# EAGLE design kolrs868_tx (EAGLE 6.5.0)
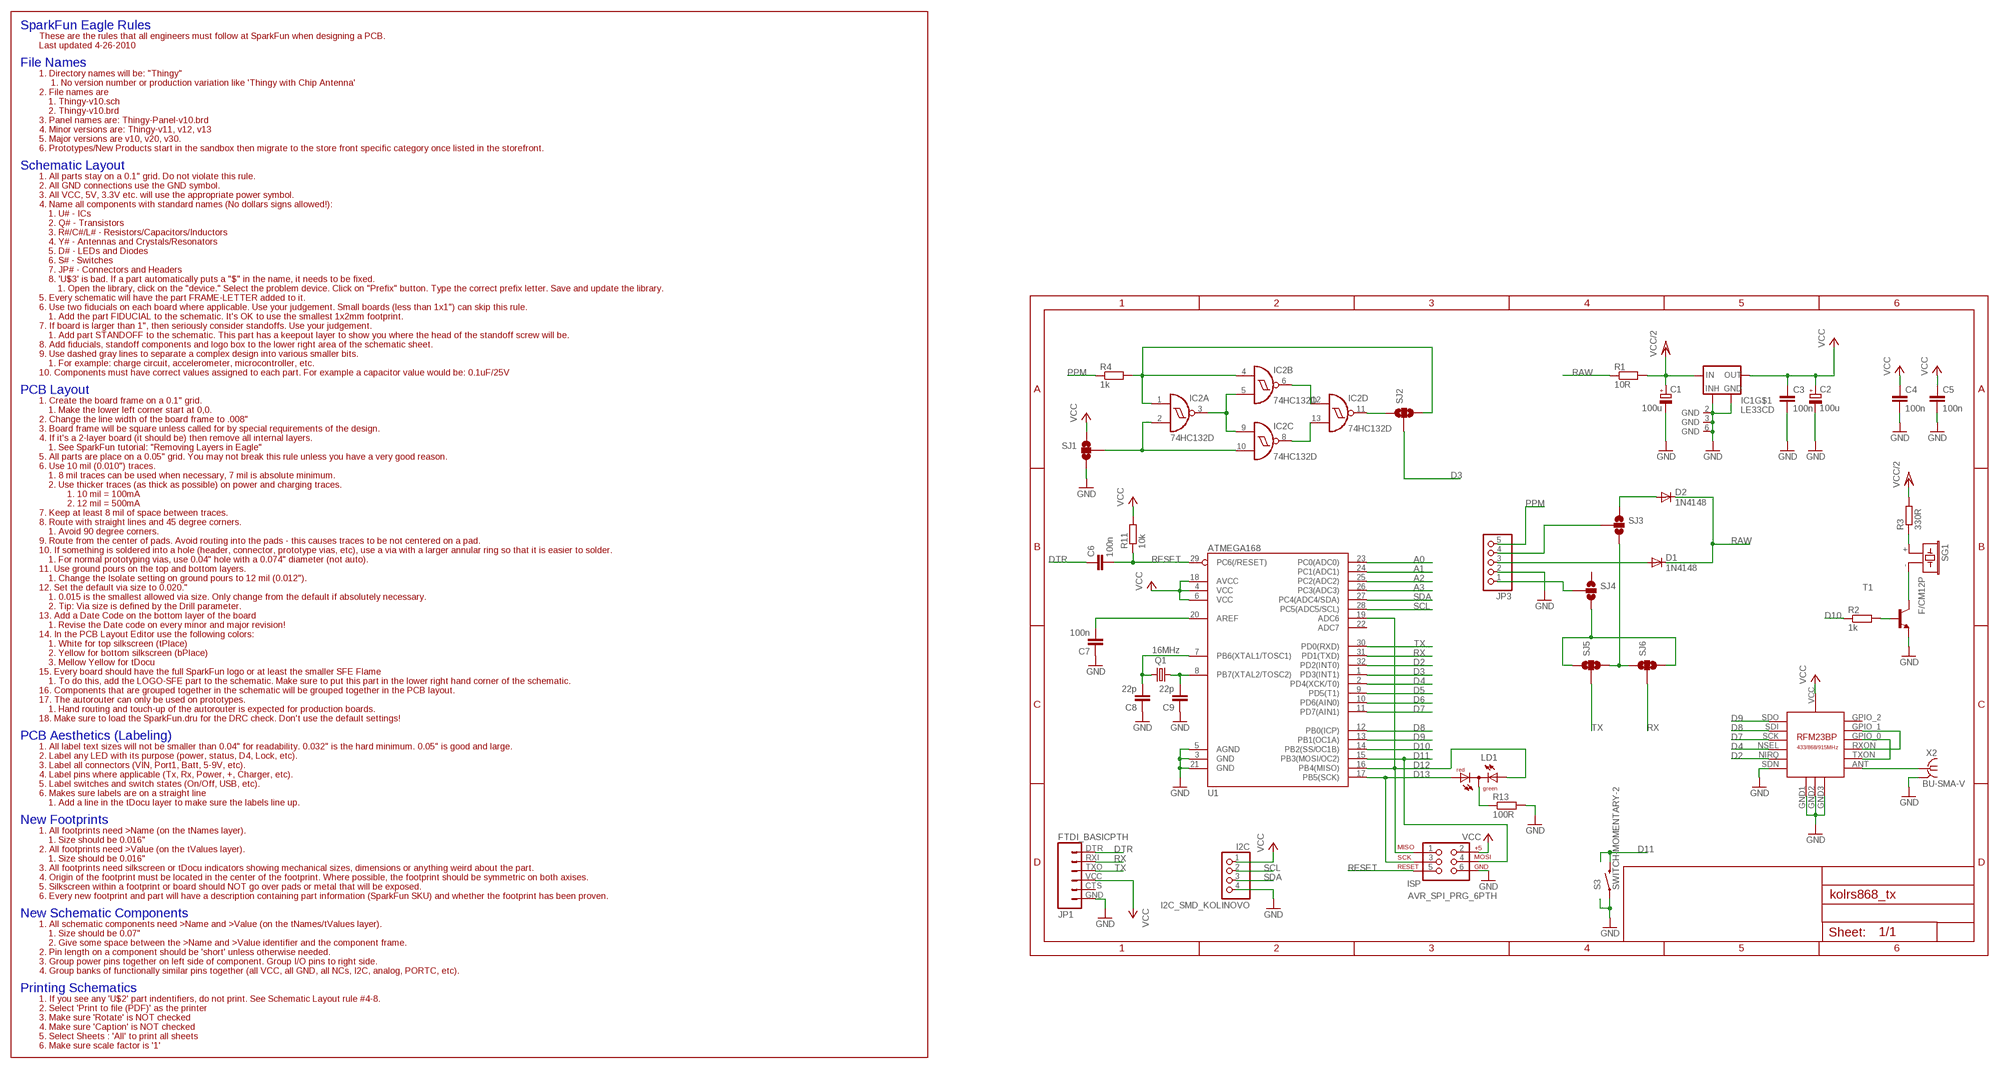
[diagram p0: schematic, sheet 1]

## Parts
C1  100u  CPOL-EUSMCB  [SMC_B]
C2  100u  CPOL-EUSMCB  [SMC_B]
C3  100n  C-EU_KOLIN  [M0805]
C4  100n  C-EU_KOLIN  [M0805]
C5  100n  C-EU_KOLIN  [M0805]
C6  100n  C-EU_KOLIN  [M0805]
C7  100n  C-EU_KOLIN  [M0805]
C8  22p  C-EU_KOLIN  [M0805]
C9  22p  C-EU_KOLIN  [M0805]
D1  1N4148  DIODE-MINIMELF  [MINIMELF]
D2  1N4148  DIODE-MINIMELF  [MINIMELF]
I2C  I2C_SMD_KOLINOVO  [1X04]
IC1  LE33CD  [SO8]
IC2  74HC132D  [SO14]
ISP  AVR_SPI_PRG_6PTH  [2X3]
JP1  FTDI_BASICPTH  [FTDI_BASIC]
JP3  PINHD-1X5  [1X05]
LD1  DUOLED-RG-C  [DUOLED-C-5MM]
Q1  16MHz  CRYSTALHC49UP  [HC49UP]
R1  10R  R-EU_KOLINM0805  [M0805]
R2  1k  R-EU_KOLINM0805  [M0805]
R3  330R  R-EU_KOLINM0805  [M0805]
R4  1k  R-EU_KOLINM0805  [M0805]
R11  10k  R-EU_KOLINM0805  [M0805]
R13  100R  R-EU_KOLINM0805  [M0805]
S3  SWITCH-MOMENTARY-2  [TACTILE_SWITCH_TALL]
SG1  F/CM12P  [F/CM12P]
SJ1  SOLDERJUMPER_2WAYS  [SJ_3]
SJ2  SOLDERJUMPER_2WAYS  [SJ_3]
SJ3  SOLDERJUMPER_2WAYS  [SJ_3]
SJ4  SOLDERJUMPER_2WAYS  [SJ_3]
SJ5  SOLDERJUMPER_2WAYS  [SJ_3]
SJ6  SOLDERJUMPER_2WAYS  [SJ_3]
T1  BC848-NPN-SOT23-BEC  [SOT23-BEC]
U1  ATMEGA168  [TQFP32-08]
U$3  RFM23BP  [RFM23BP]
X2  BU-SMA-V  [BU-SMA-V]

## Nets
A0: U1.23(PC0(ADC0))
A1: U1.24(PC1(ADC1))
A2: U1.25(PC2(ADC2))
A3: U1.26(PC3(ADC3))
D2: U1.32(PD2(INT0)) U$3.NIRQ
D3: SJ2.2 U1.1(PD3(INT1))
D4: U1.2(PD4(XCK/T0)) U$3.NSEL
D5: U1.9(PD5(T1))
D6: U1.10(PD6(AIN0))
D7: U1.11(PD7(AIN1)) U$3.SCK
D8: U1.12(PB0(ICP)) U$3.SDI
D9: U1.13(PB1(OC1A)) U$3.SDO
D10: R2.1 U1.14(PB2(SS/OC1B))
D11: ISP.4 S3.B2 U1.15(PB3(MOSI/OC2))
D12: ISP.1 LD1.AX(AG) U1.16(PB4(MISO)) U1.19(ADC6)
D13: ISP.3 LD1.AR U1.17(PB5(SCK))
DTR: C6.1 JP1.DTR
GND: C1.- C2.- C3.2 C4.2 C5.2 C7.1 C8.1 C9.1 I2C.4 IC1.2(GND) IC1.3(GND) IC1.5(INHIBIT) IC1.6(GND) IC1.7(GND) ISP.6 JP1.GND JP3.2 R13.2 S3.A2 SJ1.3 T1.E U1.3(GND) U1.5(AGND) U1.21(GND) U$3.GND1 U$3.GND2 U$3.GND3 U$3.SDN X2.2(GND)
N$1: C7.2 U1.20(AREF)
N$4: U$3.ANT X2.1
N$5: JP3.1 SJ4.2
N$6: C8.2 Q1.2 U1.7(PB6(XTAL1/TOSC1))
N$7: C9.2 Q1.1 U1.8(PB7(XTAL2/TOSC2))
N$8: LD1.C R13.1
N$10: R2.2 T1.B
N$11: SG1.- T1.C
N$12: R3.1 SG1.+
N$13: D1.A JP3.3
N$14: JP3.4 SJ3.2
N$16: D2.A SJ3.1
N$17: IC2.3(A:O) IC2.5(B:I1) IC2.9(C:I0)
N$18: IC2.11(D:O) SJ2.1
N$19: IC2.2(A:I1) IC2.10(C:I1) SJ1.2
N$20: IC2.8(C:O) IC2.13(D:I1)
N$21: IC2.6(B:O) IC2.12(D:I0)
N$24: IC2.1(A:I0) IC2.4(B:I0) R4.2 SJ2.3
N$25: SJ4.3 SJ5.1 SJ6.3
N$26: SJ3.3 SJ5.3 SJ6.1
N$31: U$3.GPIO_0 U$3.TXON
N$32: U$3.GPIO_1 U$3.RXON
PPM: JP3.5 R4.1
RAW: D1.C D2.C R1.1
RESET: C6.2 ISP.5 R11.1 U1.29(PC6(/RESET))
RX: JP1.RXI SJ6.2 U1.31(PD1(TXD))
SCL: I2C.2 U1.28(PC5(ADC5/SCL))
SDA: I2C.3 U1.27(PC4(ADC4/SDA))
TX: JP1.TXO SJ5.2 U1.30(PD0(RXD))
VCC: C2.+ C3.1 C4.1 C5.1 I2C.1 IC1.1(OUT) ISP.2 JP1.VCC R11.2 SJ1.1 U1.4(VCC) U1.6(VCC) U1.18(AVCC) U$3.VCC
VCC/2: C1.+ IC1.8(IN) R1.2 R3.2
Unconnected: JP1.CTS SJ4.1 U1.22(ADC7) U$3.GPIO_2

## Power pins joined to a net without a drawn wire
GND: IC2.7(P:GND) X2.3(GND) X2.4(GND) X2.5(GND)
VCC: IC2.14(P:VCC)

## Library data of the parts
C1 C2 = rcl:CPOL-EU: POLARIZED CAPACITOR, European symbol
C3-C9 = PINHEAD_RC:C-EU_KOLIN: CAPACITOR, European symbol
D1 D2 = diode:DIODE-: DIODE
I2C = PINHEAD_RC:I2C_SMD_KOLINOVO: PIN HEADER
IC1 = libstabilizatory:LE33CD: VOLTAGE REGULATOR WITH INHIBIT
IC2 = 74xx-eu:74*132: Quad 2-input NAND schmitt trigger
ISP = SparkFun:AVR_SPI_PRG_6: AVR ISP 6 Pin This is the reduced ISP connector for AVR programming. Common on Arduino. This footprint will take up less PCB space and can be used with a 10-pin to 6-pin adapter such as SKU: BOB-08508
JP1 = SparkFun:FTDI_BASIC: FTDI Basic: 3.3V and 5V
JP3 = pinhead:PINHD-1X5: PIN HEADER
LD1 = led:DUOLED-RG-C: DUO LED 2 colors (red/green), 5 mm, round, common Cathode www.ligitek.com or other producers.
Q1 = crystal:CRYSTAL: CRYSTAL; OC_FARNELL: unknown; OC_NEWARK: unknown
R1-R4 R11 R13 = PINHEAD_RC:R-EU_KOLIN: RESISTOR, European symbol
S3 = SparkFun:SWITCH-MOMENTARY-2
SG1 = buzzer:F/CM12P: BUZZER Source: Buerklin
SJ1-SJ6 = SparkFun:SOLDERJUMPER_2WAY: Solder Jumper 2 way solder jumper
T1 = transistor:*-NPN-: NPN Transistror BF959 corrected 2008.03.06
U1 = SparkFun:ATMEGA168
U$3 = RFM23BP:RFM23BP: HopeRF RFM23BP Library by: http://projects.weber-itam.de
X2 = con-coax:BU-SMA-V: FEMALE SMA CONNECTOR Radiall distributor RS 112-3794; OC_FARNELL: unknown; OC_NEWARK: unknown

## Board
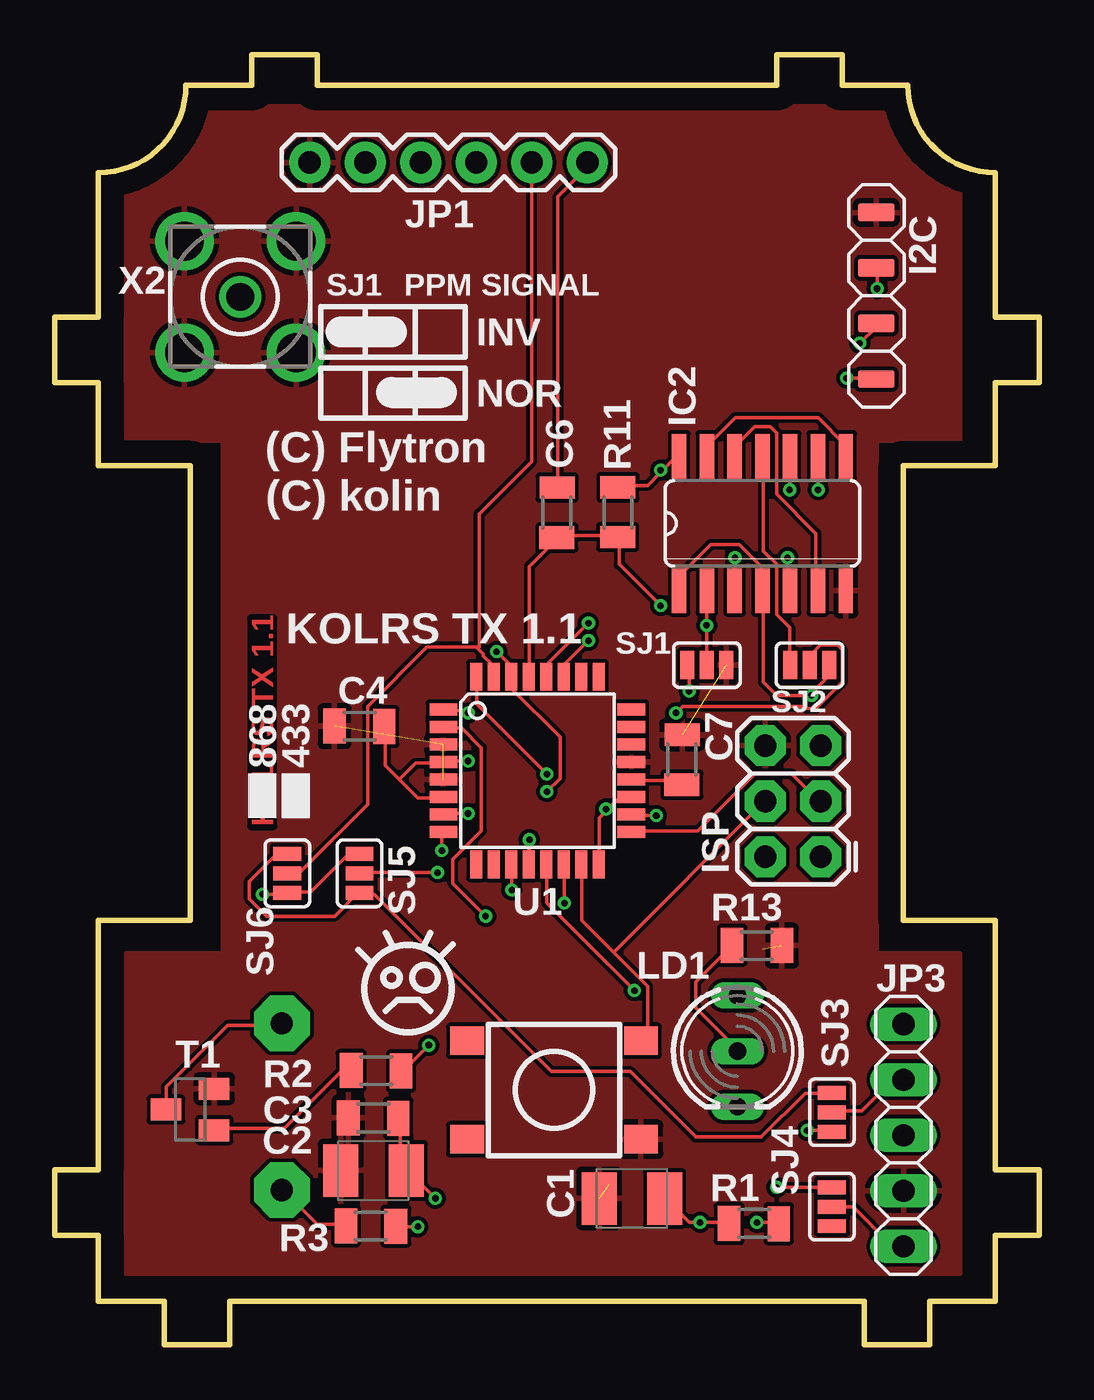
[diagram p1: board, top side]
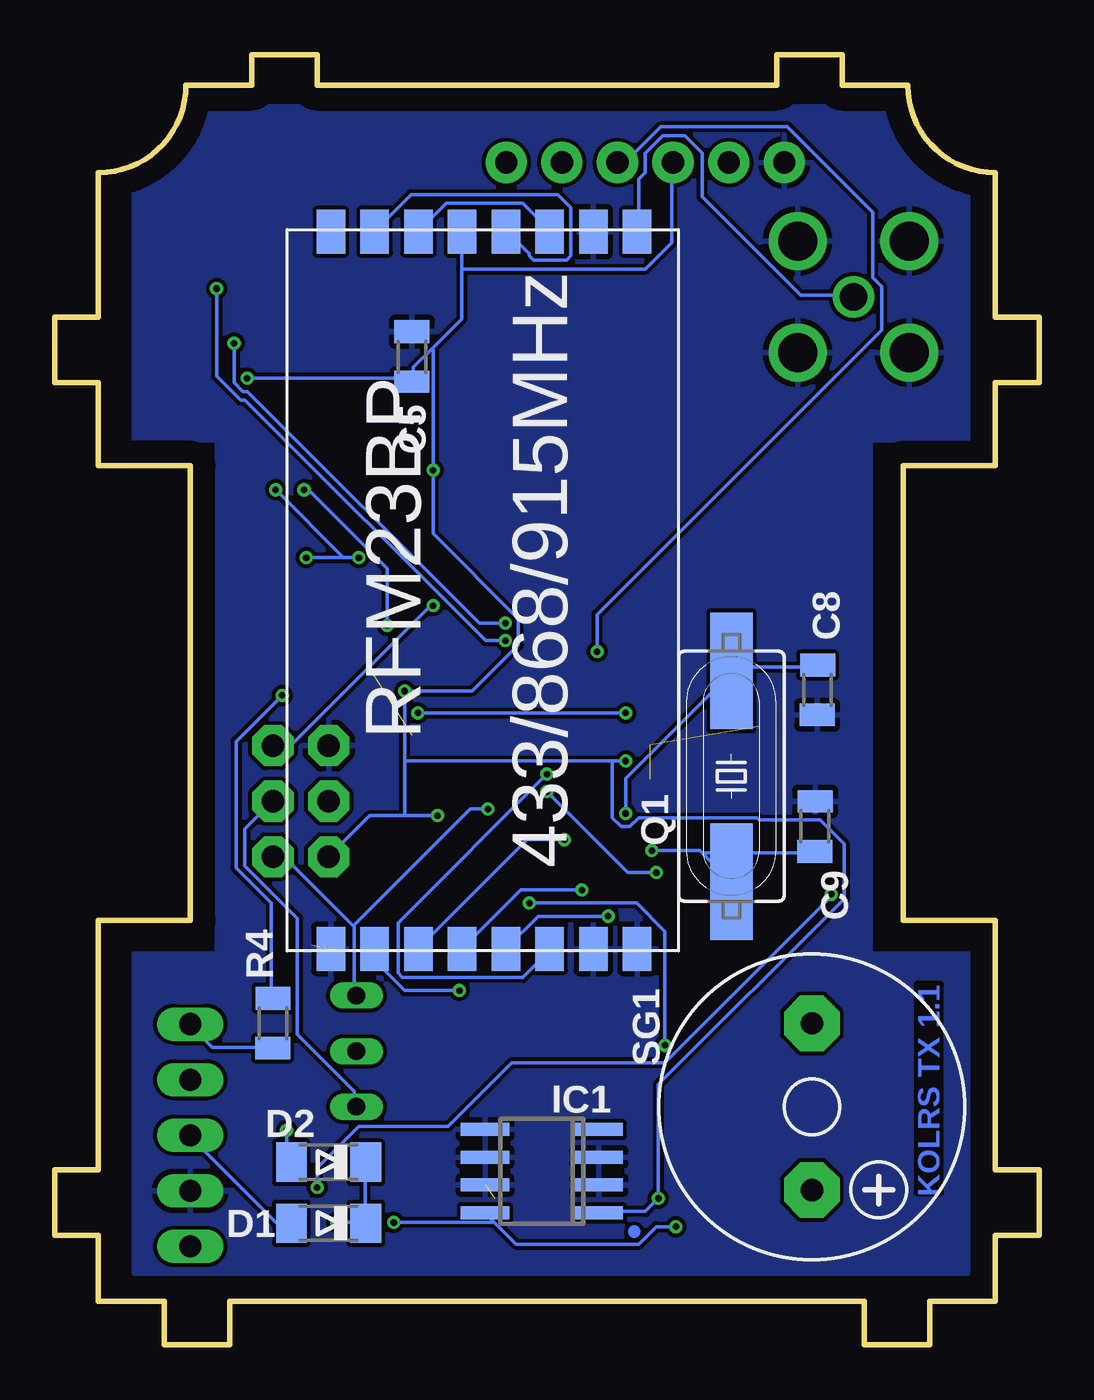
[diagram p2: board, bottom side, seen from below]

Size 45 x 59 mm. Coordinates in mm from the lower left corner, seen from the top.
Outline: 2,2 5,2 5,0 8,0 8,2 37,2 37,0 40,0 40,2 43,2 43,5 45,5 45,8 43,8 43,19.4 38.8,19.4 38.8,40.2 43,40.2 43,44 45,44 45,47 43,47 43,53.6 arc-90 39,57.6 36,57.6 36,59 33,59 33,57.6 12,57.6 12,59 9,59 9,57.6 6,57.6 arc-90 2,53.6 2,47 0,47 0,44 2,44 2,40.2 6.2,40.2 6.2,19.4 2,19.4 2,8 0,8 0,5 2,5 2,2
Copper layers (1*16): Top 0.018mm / dielectric 1.5mm / Bottom 0.018mm
Design rules "default": minimum track width 0.15mm, minimum drill 0.3mm, track to track 0.18mm, track to pad 0.18mm, pad to pad 0.18mm, via to via 0.18mm, smd to smd 0.18mm, copper to edge 40mil, drill to drill 8mil, minimum pad ring 0.15mm, minimum via ring 0.15mm, stop-mask expansion 4mil, vias tented up to drill 0.5mm, thermal gap 10mil

### Footprints (pad centres in the part's own frame; a part is rotated, then mirrored left to right if it is on the bottom)
SMC_B = smd 1.6 x 2.4: + -1.5,0; - 1.5,0
M0805 = smd 1.021 x 1.6: 1 -1.131,0.017 | smd 1.046 x 1.6: 2 1.148,0
MINIMELF = smd 1.4 x 1.8: A 1.7,0; C -1.7,0
1X04 = smd 0.813 x 1.676: 1 -3.81,0; 2 -1.27,0; 3 1.27,0; 4 3.81,0
SO8 = smd 0.6 x 2.2: 1 -1.905,-2.6; 2 -0.635,-2.6; 3 0.635,-2.6; 4 1.905,-2.6; 5 1.905,2.6; 6 0.635,2.6; 7 -0.635,2.6; 8 -1.905,2.6
SO14 = smd 0.66 x 2.032: 1 -3.81,-3.073; 2 -2.54,-3.073; 3 -1.27,-3.073; 4 0,-3.073; 5 1.27,-3.073; 6 2.54,-3.073; 7 3.81,-3.073; 8 3.81,3.073; 9 2.54,3.073; 10 1.27,3.073; 11 0,3.073; 12 -1.27,3.073; 13 -2.54,3.073; 14 -3.81,3.073
2X3 = drill 1.016 pad 1.88 octagon: 1 0,0; 2 0,2.54; 3 2.54,0; 4 2.54,2.54; 5 5.08,0; 6 5.08,2.54
FTDI_BASIC = drill 1.016 pad 1.88: CTS 10.16,0; DTR 0,0; GND 12.7,0; RXI 2.54,0; TXO 5.08,0; VCC 7.62,0
1X05 = drill 1.016 long: 1 -5.08,0; 2 -2.54,0; 3 0,0; 4 2.54,0; 5 5.08,0
DUOLED-C-5MM = drill 0.813 long: AR 2.54,0; AX -2.54,0; C 0,0
HC49UP = smd 5.334 x 1.93: 1 -4.826,0; 2 4.826,0
TACTILE_SWITCH_TALL = smd 1.55 x 1.3: A1 -3.975,-2.25; A2 3.975,-2.25; B1 -3.975,2.25; B2 3.975,2.25
F/CM12P = drill 1.016 pad 2.54 octagon: + 3.81,0; - -3.81,0
SJ_3 = smd 0.635 x 1.27: 1 -0.889,0; 2 0,0; 3 0.889,0
SOT23-BEC = smd 1 x 1.4: B -0.95,-1.1; C 0,1.1; E 0.95,-1.1
TQFP32-08 = smd 1.27 x 0.559: 1 -4.293,2.8; 2 -4.293,2; 3 -4.293,1.2; 4 -4.293,0.4; 5 -4.293,-0.4; 6 -4.293,-1.2; 7 -4.293,-2; 8 -4.293,-2.8; 17 4.293,-2.8; 18 4.293,-2; 19 4.293,-1.2; 20 4.293,-0.4; 21 4.293,0.4; 22 4.293,1.2; 23 4.293,2; 24 4.293,2.8 | smd 0.559 x 1.27: 9 -2.8,-4.293; 10 -2,-4.293; 11 -1.2,-4.293; 12 -0.4,-4.293; 13 0.4,-4.293; 14 1.2,-4.293; 15 2,-4.293; 16 2.8,-4.293; 25 2.8,4.293; 26 2,4.293; 27 1.2,4.293; 28 0.4,4.293; 29 -0.4,4.293; 30 -1.2,4.293; 31 -2,4.293; 32 -2.8,4.293
RFM23BP = smd 2 x 1.3: ANT 16.9,-7.5; GND1 -15.9,6.5; GND2 -15.9,-7.5; GND3 16.9,-5.5; GPIO_0 16.9,2.5; GPIO_1 16.9,4.5; GPIO_2 16.9,6.5; NIRQ -15.9,-3.5; NSEL -15.9,-1.5; RXON 16.9,-1.5; SCK -15.9,0.5; SDI -15.9,2.5; SDN -15.9,-5.5; SDO -15.9,4.5; TXON 16.9,-3.5; VCC 16.9,0.5
BU-SMA-V = drill 1.27: 1 0,0 | drill 1.778: 2 -2.55,2.55; 3 2.55,2.55; 4 2.55,-2.55; 5 -2.55,-2.55

### Placement (x,y rotation side)
C1  26.38,6.7 180 top
C2  14.57,7.97 180 top
C3  14.57,10.38 180 top
C4  13.94,28.29 180 top
C5  28.67,45.18 90 bottom
C6  22.95,38.07 270 top
C7  28.67,26.77 270 top
C8  10.13,29.94 90 bottom
C9  10.26,23.72 270 bottom
D1  32.48,5.56 180 bottom
D2  32.48,8.35 180 bottom
I2C  37.56,47.97 90 top
IC1  22.73,7.94 90 bottom
IC2  32.35,37.56 0 top
ISP  35.02,22.32 90 top
JP1  24.35,54.07 180 top
JP3  38.81,9.58 90 top
LD1  31.21,13.43 270 top
Q1  14.06,26 90 bottom
R1  31.97,5.56 180 top
R2  14.7,12.54 180 top
R3  14.45,5.43 0 top
R4  35.02,14.7 90 bottom
R11  25.75,38.07 90 top
R13  32.1,18.26 0 top
S3  22.83,11.65 0 top
SG1  10.38,10.89 270 bottom
SJ1  29.81,31.08 0 top
SJ2  34.51,31.08 0 top
SJ3  35.53,10.64 90 top
SJ4  35.53,6.32 90 top
SJ5  13.94,21.56 270 top
SJ6  10.64,21.56 270 top
T1  6.19,10.76 90 top
U1  22.07,26.26 0 top
U$3  25.88,34 90 bottom
X2  8.48,47.92 0 top

### Tracks (layer width: path | path; a pad name or v marks a point on that pad's centre or on a via)
D2  (via drill 0.3)
  Top 0.15: v22.5,26.1 19.3,29.3 19.3,30.5 U1.32
  Bottom 0.15: v22.5,26.1 29.3,19.3 29.3,17 29.1,16.8 23.6,16.8 22.3,18.1 U$3.NIRQ
D3  (via drill 0.3)
  Top 0.15: v18.9,28.9 18.8,29 17.8,29 U1.1 | v28.4,28.9 28.7,29.2 34.3,29.2 34.4,29.1 34.8,29.1 36,30.3 36,31.8 35.8,32 35,32 34.6,31.6 34.6,31.1 SJ2.2
  Bottom 0.15: v28.4,28.9 v18.9,28.9
D4  (via drill 0.3)
  Top 0.15: v19.7,19.6 18.2,21.1 18.2,22.2 19.5,23.5 19.5,27.3 18.6,28.2 17.8,28.2 U1.2
  Bottom 0.15: v19.7,19.6 22.9,19.6 24.3,18.2 U$3.NSEL
D7  (via drill 0.3)
  Top 0.15: v20.9,20.8 20.9,21.9 U1.11
  Bottom 0.15: v20.9,20.8 23.7,20.8 26.3,18.2 U$3.SCK
D8  (via drill 0.3)
  Top 0.15: v21.7,23.1 21.7,22 U1.12
  Bottom 0.15: v21.7,23.1 23.4,23.1 28.3,18.2 U$3.SDI
D9  (via drill 0.3)
  Top 0.15: v26.5,16.2 22.5,20.2 22.5,21.9 U1.13
  Bottom 0.15: v26.5,16.2 29,16.2 30.3,17.5 30.3,18.1 U$3.SDO
D10  (via drill 0.3)
  Top 0.15: v23.3,20.2 23.3,21.9 U1.14 | v17.1,13.7 15.9,12.5 R2.1
  Bottom 0.15: v23.3,20.2 18.4,20.2 17.1,18.9 v17.1,13.7
D11
  Top 0.15: 25.55,17.95 27.1,16.4 27.1,14.2 26.9,14 S3.B2 | 25.55,17.95 24.1,19.4 24.1,21.9 U1.15 | 25.55,17.95 32.4,24.8 ISP.4
D12  (via drill 0.3)
  Top 0.15: 25.25,24.45 25.8,25 26.3,25 U1.19 | 25.25,24.45 24.9,24.1 24.9,22 U1.16 | v25.2,24.5 25.25,24.45
  Bottom 0.15: 31.35,19.15 34.5,22.3 35,22.3 ISP.1 | 31.35,19.15 31.3,19.1 31.3,16 LD1.AX | v25.2,24.5 26,24.5 31.35,19.15
D13
  Top 0.15: U1.17 26.4,23.5 29.4,23.5 32,26.1 33.7,26.1 35,24.8 ISP.3
  Bottom 0.15: LD1.AR 31.3,10.9 31.3,11.6 33.9,14.2 33.9,19.5 36.3,21.9 36.3,23.6 35.1,24.8 ISP.3
DTR
  Top 0.15: C6.1 23,39.2 23,52.5 24.3,53.8 24.3,54 JP1.DTR
GND  (5 unrouted)
  pour Bottom: 3.27,3.27 41.37,3.27 41.37,17.88 37.56,17.88 37.56,41.37 41.37,41.37 41.37,52.8 37.56,56.61 7.08,56.61 3.27,52.8 3.27,41.37 7.71,41.37 7.71,17.88 3.27,17.88
  pour Top: 3.27,3.27 41.37,3.27 41.37,17.88 37.56,17.88 37.56,41.37 41.37,41.37 41.37,52.8 37.56,56.61 7.08,56.61 3.27,52.8 3.27,41.37 7.71,41.37 7.71,17.88 3.27,17.88
N$1
  Top 0.15: U1.20 26.4,25.8 28.5,25.8 28.6,25.7 C7.2
N$4
  Bottom 0.15: U$3.ANT 18.3,51 18.3,53.3 18,53.6 18,54.5 17.2,55.3 16.2,55.3 15.4,54.5 15.4,52.5 10.9,48 8.5,48 X2.1
N$5
  Top 0.15: SJ4.2 35.6,6.3 36.5,6.3 38.2,4.6 38.8,4.6 JP3.1
N$6  (via drill 0.3)
  Top 0.15: v18.9,24.3 17.8,24.3 U1.7
  Bottom 0.15: v18.9,24.3 18.9,25.9 14,30.8 Q1.2 14,30.9 13.9,31 10.2,31 C8.2
N$7  (via drill 0.3)
  Top 0.15: v17.7,22.6 17.7,23.4 U1.8
  Bottom 0.15: v17.7,22.6 15.5,22.6 15.35,22.45 | 15.35,22.45 14.1,21.2 Q1.1 | C9.2 10.3,22.5 15.3,22.5 15.35,22.45
N$8
  Top 0.15: R13.1 30.9,18.2 29.3,16.6 29.3,15.4 31.2,13.5 LD1.C
N$10
  Top 0.15: T1.B 7.3,9.9 10.5,9.9 13.1,12.5 13.5,12.5 R2.2
N$11
  Top 0.15: T1.C 5.1,10.8 5.1,11.8 7.9,14.6 10.3,14.6 SG1.-
N$12
  Top 0.15: R3.1 13.3,5.5 12,5.5 10.4,7.1 SG1.+
N$13
  Bottom 0.15: D1.A 34.2,5.6 34.9,5.6 38.8,9.5 JP3.3
N$14
  Top 0.15: SJ3.2 35.6,10.7 36.9,10.7 38.3,12.1 38.8,12.1 JP3.4
N$16  (via drill 0.3)
  Top 0.15: v34.4,9.8 35.5,9.8 SJ3.1
  Bottom 0.15: v34.4,9.8 34.4,8.6 34.2,8.4 D2.A
N$17  (via drill 0.3)
  Top 0.15: v31.1,36 31.1,34.5 IC2.3 | v33.5,36 33.5,34.6 33.6,34.5 IC2.5 | v34.9,39.1 34.9,40.6 IC2.9
  Bottom 0.15: v33.5,36 31.8,36 | 31.8,36 v31.1,36 | 31.8,36 v34.9,39.1
N$18
  Top 0.15: SJ2.1 33.6,31.1 33.6,32.8 33,33.4 33,35.7 32.4,36.3 32.4,40.6 IC2.11
N$19  (via drill 0.3)
  Top 0.15: SJ1.2 29.8,31.1 v29.8,32.9 29.8,34.4 IC2.2 | v33.6,39.1 33.6,40.6 IC2.10
  Bottom 0.15: v33.6,39.1 33.4,39.1 29.8,35.5 v29.8,32.9
N$20
  Top 0.15: IC2.13 29.9,40.7 29.9,41.2 31.1,42.4 34.9,42.4 36.1,41.2 36.1,40.7 IC2.8
N$21
  Top 0.15: IC2.6 34.8,34.5 34.8,37.1 33,38.9 33,41.7 32.7,42 32,42 31.1,41.1 31.1,40.7 IC2.12
N$24  (via drill 0.3)
  Top 0.15: 34.55,29.75 34.5,29.7 33,29.7 32.4,30.3 32.4,34.4 IC2.4 32.3,34.5 32.3,35.6 31.3,36.6 30,36.6 28.6,35.2 28.6,34.5 IC2.1 | 34.55,29.75 35.4,30.6 35.4,31 SJ2.3 | v34.6,29.7 34.55,29.75
  Bottom 0.15: v34.6,29.7 36.7,27.6 36.7,21.8 35.1,20.2 35.1,15.9 R4.2
N$25  (via drill 0.3)
  Top 0.15: SJ5.1 13.9,22.4 13.4,22.4 11.7,20.7 10.7,20.7 SJ6.3 10.6,20.6 v9.5,20.6 | v33,7.2 35.5,7.2 SJ4.3
  Bottom 0.15: v33,7.2 33,8.1 31.1,10 27,10 24.1,12.9 17.1,12.9 9.5,20.5 v9.5,20.6
N$26
  Top 0.15: SJ6.1 10.6,22.4 10.1,22.4 8.9,21.2 8.9,20.4 9.7,19.6 12.8,19.6 13.9,20.7 SJ5.3 14,20.6 14.6,20.6 22.7,12.5 26.3,12.5 29.3,9.5 32.3,9.5 34.3,11.5 35.5,11.5 SJ3.3
N$31
  Bottom 0.15: U$3.TXON 22.4,51 23.6,52.2 27.1,52.2 28.3,51 U$3.GPIO_0
N$32
  Bottom 0.15: U$3.RXON 24.3,50.9 23.3,49.9 23.3,49.8 23.1,49.6 21.6,49.6 21.4,49.8 21.4,52 22,52.6 28.7,52.6 30.3,51 U$3.GPIO_1
PPM
  Bottom 0.15: R4.1 35.1,13.6 37.8,13.6 38.8,14.6 JP3.5
RAW  (via drill 0.3)
  Top 0.15: v32.1,5.6 33.1,5.6 R1.1
  Bottom 0.15: 30.8,5.6 v32.1,5.6 | 30.8,5.6 30.8,8.3 D2.C | 30.8,5.6 D1.C
RESET  (via drill 0.3)
  Top 0.15: U1.29 21.7,30.6 21.7,35.6 23,36.9 C6.2 23,37 25.7,37 R11.1 25.8,36.9 25.8,35.7 v27.7,33.8
  Bottom 0.15: v27.7,33.8 27.8,33.8 34.2,27.4 35,27.4 ISP.5
RX
  Top 0.15: 19.35,31.85 19.6,31.6 19.6,31.5 20,31.1 20,30.6 U1.31 | 19.35,31.85 19.3,31.9 17,31.9 14.3,29.2 14.3,24.7 11.2,21.6 10.7,21.6 SJ6.2 | JP1.RXI 21.8,54 21.8,40.4 19.4,38 19.4,31.9 19.35,31.85
SCL  (via drill 0.3)
  Top 0.15: v24.4,33 22.5,31.1 22.5,30.6 U1.28 | v36.8,45.8 37.5,46.5 37.5,46.7 I2C.2
  Bottom 0.15: v24.4,33 25.6,33 36.2,43.6 36.4,43.6 36.8,44 v36.8,45.8
SDA  (via drill 0.3)
  Top 0.15: v24.4,32.2 23.3,31.1 23.3,30.6 U1.27 | v37.6,48.3 37.6,49.2 I2C.3
  Bottom 0.15: v24.4,32.2 25.3,32.2 36.3,43.2 36.5,43.2 37.6,44.3 v37.6,48.3
TX  (via drill 0.3)
  Top 0.15: v17.5,21.6 14,21.6 SJ5.2 | v22.5,25.3 23.1,25.9 23.1,27.8 20.9,30 20.9,30.5 U1.30 20.8,30.6 20.8,31.1 v20.2,31.7
  Bottom 0.15: v17.5,21.6 18.8,21.6 v22.5,25.3 | v20.2,31.7 20.2,33.4 7.2,46.4 7.2,48.4 7.6,48.8 7.6,51.8 11.5,55.7 17.3,55.7 18.9,54.1 19.2,54.1 JP1.TXO
VCC  (via drill 0.3)
  Top 0.15: 27.75,39.95 28.5,40.7 IC2.14 | 27.75,39.95 27.1,39.3 25.8,39.3 R11.2 | v36.2,44.2 37.5,44.2 I2C.1 | v27.7,40 27.75,39.95 | C3.1 15.8,10.3 15.8,8.2 16,8 C2.+ 16.1,8 v17.4,6.7 | 15.75,25.85 15.1,26.5 15.1,28.2 C4.1 | 15.75,25.85 16.6,25 17.7,25 U1.6 | 15.75,25.85 16.5,26.6 17.7,26.6 U1.4 17.8,26.7 v18.9,26.7 | v27.5,24.2 26.4,24.2 U1.18 | v29,29.9 29,31 SJ1.1
  Bottom 0.15: 28.6,44.2 28.6,44.7 27.75,45.55 | 28.6,44.2 28.6,44.1 C5.1 28.6,44.2 | 27.75,45.55 26.4,46.9 26.4,49.2 | 26.4,49.2 26.4,50.9 U$3.VCC | 28.6,44.2 v36.2,44.2 | 27.75,45.55 27.7,45.5 v27.7,40 27.7,37.1 23.8,33.2 23.8,32 25.9,29.9 v29,29.9 29,26.7 | 26.4,49.2 18,49.2 16.8,50.4 16.8,54 JP1.VCC | IC1.1 20.1,6.1 18,6.1 v17.4,6.7 17.4,11.9 8.9,20.4 8.9,22.9 10,24 12.8,24 12.9,24.1 18.3,24.1 18.7,23.7 19.1,23.7 19.5,24.1 19.5,26.7 | 29,24.2 30.6,24.2 32.4,22.4 ISP.2 | 29,24.2 v27.5,24.2 | 29,24.2 29,26.7 | 29,26.7 19.5,26.7 | 19.5,26.7 v18.9,26.7
VCC/2  (via drill 0.3)
  Top 0.15: R1.2 30.8,5.6 v29.5,5.6 29,5.6 27.9,6.7 C1.+ | v16.6,5.4 15.6,5.4 R3.2
  Bottom 0.15: v16.6,5.4 17.5,5.4 18.3,4.6 23.9,4.6 24.95,5.65 | 24.95,5.65 25.3,6 IC1.8 | v29.5,5.6 25,5.6 24.95,5.65
(copper drawn outside any net)
  shapes: Bottom circle x1

### Text on the board
Top: KOLRS TX 1.1
Bottom: KOLRS TX 1.1
tPlace: SJ1 | PPM SIGNAL | INV | NOR | (C) Flytron | (C) kolin | KOLRS TX 1.1 | 868 | 433